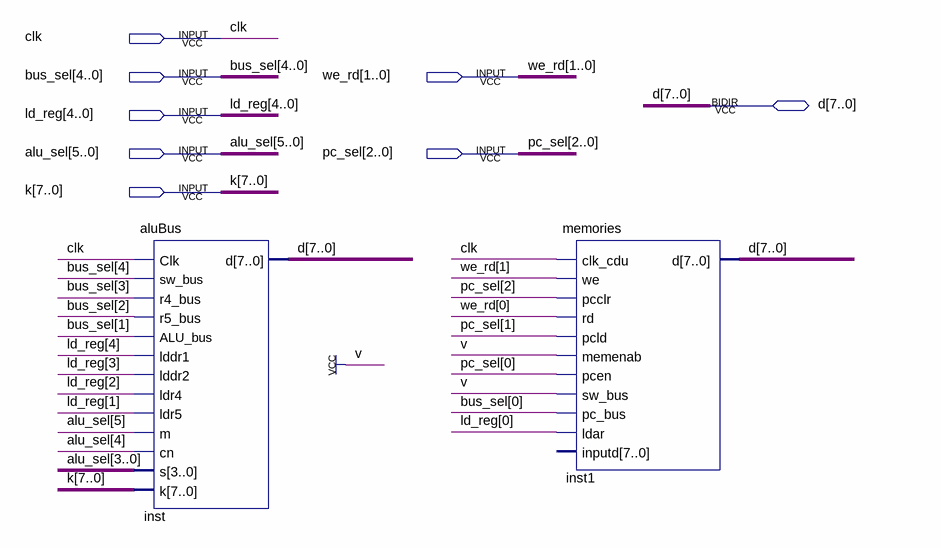
[diagram p0: schematic sheet]
// Quartus schematic CPU.bdf as structural Verilog: 2 symbols, 8 pins
module CPU (
  input  clk,
  input  [4:0] bus_sel,
  input  [1:0] we_rd,
  input  [4:0] ld_reg,
  input  [5:0] alu_sel,
  input  [2:0] pc_sel,
  input  [7:0] k,
  inout  [7:0] d
);

  aluBus inst (
    .Clk(clk), .sw_bus(bus_sel[4]), .r4_bus(bus_sel[3]), .r5_bus(bus_sel[2]), .ALU_bus(bus_sel[1]),
    .lddr1(ld_reg[4]), .lddr2(ld_reg[3]), .ldr4(ld_reg[2]), .ldr5(ld_reg[1]), .m(alu_sel[5]),
    .cn(alu_sel[4]), .s(alu_sel[3:0]), .k(k), .d(d));
  memories inst1 (
    .clk_cdu(clk), .we(we_rd[1]), .pcclr(pc_sel[2]), .rd(we_rd[0]), .pcld(pc_sel[1]), .memenab(1'b1),
    .pcen(pc_sel[0]), .sw_bus(1'b1), .pc_bus(bus_sel[0]), .ldar(ld_reg[0]), .d(d));  // open: inputd
endmodule
